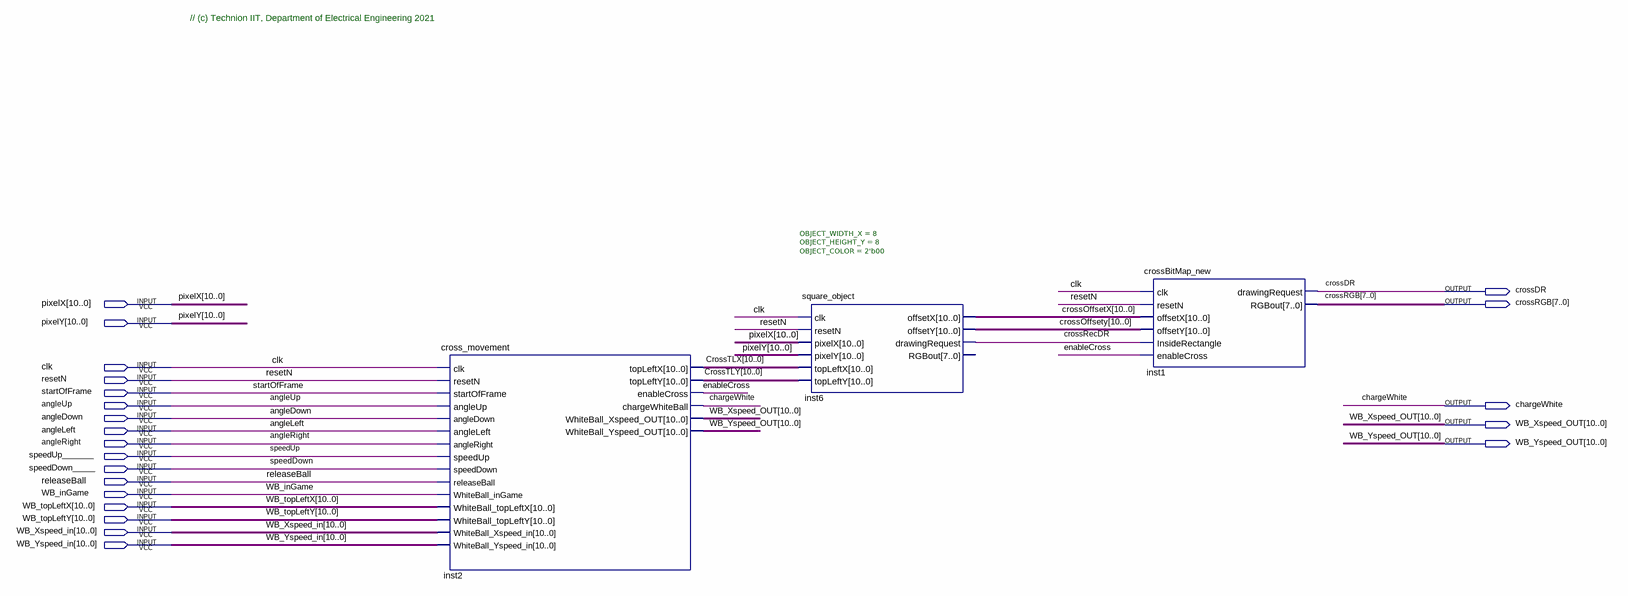
[diagram p0: schematic sheet]
// Quartus schematic Cross_Block.bdf as structural Verilog: 3 symbols, 22 pins
module Cross_Block (
  input  [10:0] pixelX,
  input  [10:0] pixelY,
  input  clk,
  input  resetN,
  input  startOfFrame,
  input  angleUp,
  input  angleDown,
  input  angleLeft,
  input  angleRight,
  input  speedUp_______,
  input  speedDown_____,
  input  releaseBall,
  input  WB_inGame,
  input  [10:0] WB_topLeftX,
  input  [10:0] WB_topLeftY,
  input  [10:0] WB_Xspeed_in,
  input  [10:0] WB_Yspeed_in,
  output crossDR,
  output [7:0] crossRGB,
  output chargeWhite,
  output [10:0] WB_Xspeed_OUT,
  output [10:0] WB_Yspeed_OUT
);

  wire crossRecDR, enableCross;
  wire [10:0] crossOffsetX, crossOffsety, CrossTLX, CrossTLY;

  cross_movement inst2 (
    .clk(clk), .resetN(resetN), .startOfFrame(startOfFrame), .angleUp(angleUp), .angleDown(angleDown),
    .angleLeft(angleLeft), .angleRight(angleRight), .speedUp(speedUp_______), .speedDown(speedDown_____),
    .releaseBall(releaseBall), .WhiteBall_inGame(WB_inGame), .WhiteBall_topLeftX(WB_topLeftX),
    .WhiteBall_topLeftY(WB_topLeftY), .WhiteBall_Xspeed_in(WB_Xspeed_in), .WhiteBall_Yspeed_in(WB_Yspeed_in),
    .topLeftX(CrossTLX), .topLeftY(CrossTLY), .enableCross(enableCross), .chargeWhiteBall(chargeWhite),
    .WhiteBall_Xspeed_OUT(WB_Xspeed_OUT), .WhiteBall_Yspeed_OUT(WB_Yspeed_OUT));
  square_object #(.OBJECT_WIDTH_X(8), .OBJECT_HEIGHT_Y(8), .OBJECT_COLOR(2'b00)) inst6 (
    .clk(clk), .resetN(resetN), .pixelX(pixelX), .pixelY(pixelY), .topLeftX(CrossTLX), .topLeftY(CrossTLY),
    .offsetX(crossOffsetX), .offsetY(crossOffsety), .drawingRequest(crossRecDR));  // open: RGBout
  crossBitMap_new inst1 (
    .clk(clk), .resetN(resetN), .offsetX(crossOffsetX), .offsetY(crossOffsety), .InsideRectangle(crossRecDR),
    .enableCross(enableCross), .drawingRequest(crossDR), .RGBout(crossRGB));

  // Other names for the same wires on the sheet: speedDown = speedDown_____; speedUp = speedUp_______

  // Notes on the sheet:
  //   // (c) Technion IIT, Department of Electrical Engineering 2021
endmodule
